# Altium schematic sheet 1_Triangle Wave Generator.SchDoc
size A4; SheetNumber: 2; SheetTotal: 6
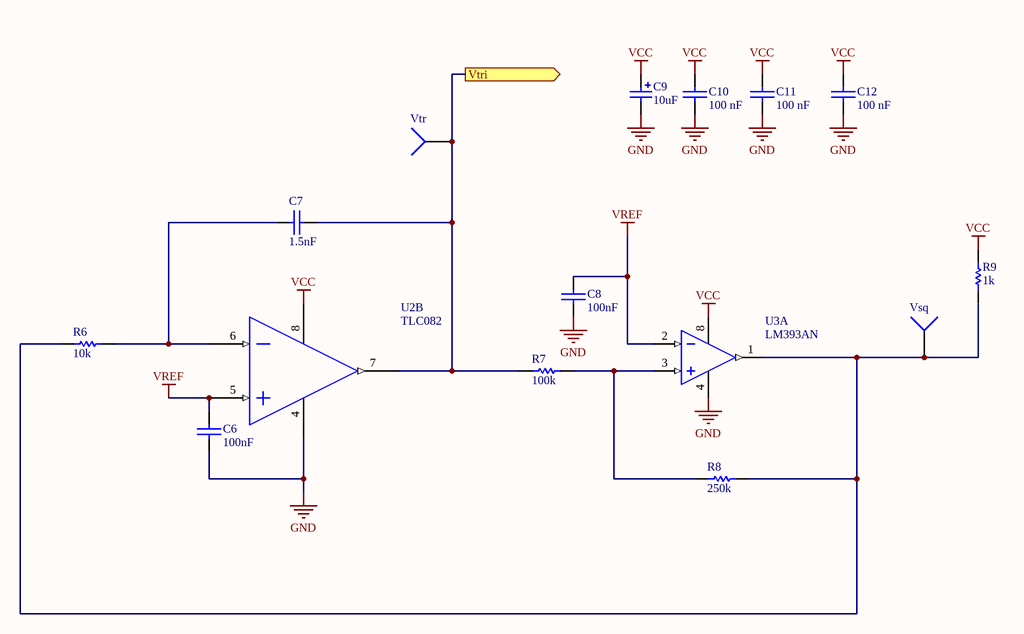
[diagram p0: 1_Triangle Wave Generator.SchDoc]

## Parts
C6  100nF  [ece-RAD0.2]
C7  1.5nF  [ece-RAD0.2]
C8  100nF  [ece-RAD0.2]
C9  10uF  [ece-CAPAD2TH0.3]
C10  100 nF  [ece-RAD0.2]
C11  100 nF  [ece-RAD0.2]
C12  100 nF  [ece-RAD0.2]
R6  10k  [ece-AXIAL0.4]
R7  100k  [ece-AXIAL0.4]
R8  250k  [ece-AXIAL0.4]
R9  1k  [ece-AXIAL0.4]
U2  TLC082  [ECE-DIP8]  (part B of 2)
U3  LM393AN  [ECE-DIP8]  (part A of 2)
Vsq  GND  [ece-HDR1]  (value not drawn)
Vtr  GND  [ece-HDR1]  (value not drawn)

## Ports
Vtri (out)

## Nets
GND: C6.1 C8.1 C9.2 C10.2 C11.2 C12.2 U2.4(GND) U3.4(GND)
VCC: C9.1 C10.1 C11.1 C12.1 R9.2 U2.8(V(+)) U3.8(V+)
VREF: C6.2 C8.2 U2.5(IN2(+)) U3.2(IN-)
Vtri: C7.2 R7.1 U2.7(OUT2) Vtr.1 ; port Vtri
NetC7_1: C7.1 R6.2 U2.6(IN2(-))
NetR6_1: R6.1 R8.2 R9.1 U3.1(OUT) Vsq.1
NetR7_2: R7.2 R8.1 U3.3(IN+)

## Library data of the parts
C6-C8 C10-C12 = CAP: Capacitor Non Polarised Through Hole
  C6 C8: Value: 100nF
  C7: Value: 1.5nF
  C10-C12: Value: 100 nF
C9 = CAP 22uF TH: Polarized Capacitor (Radial); Manufacturer: Generic Components; Class I: Passive; Published: 8-Jun-2000; Revision: July-2002: Re-released for DXP Platform.; Publisher: Altium Limited; Class II: Capacitor; Value: 10uF
R6-R9 = Res1: Resistor; Published: 8-Jun-2000; LatestRevisionDate: 17-Jul-2002; LatestRevisionNote: Re-released for DXP Platform.; PackageReference: AXIAL-0.3; Publisher: Altium Limited
  R6: Value: 10k
  R7: Value: 100k
  R8: Value: 250k
  R9: Value: 1k
U3 = LM393AN: Dual Comparator; Published: 17-Jul-2002; LatestRevisionDate: 06-Jun-2005; LatestRevisionNote: Stylized 3D Model Added.; DatasheetVersion: 1988; PackageReference: 626-05; Publisher: Altium Limited; PackageDescription: DIP; 8 Leads; Row Spacing 7.62 mm; Pitch 2.54 mm; ComponentLink1Description: Manufacturer Link; ComponentLink1URL: http://www.onsemi.com/site/products/taxonomy/0,4438,133,00.html
Vsq Vtr = Test pin: Socket; LatestRevisionDate: 17-Jul-2002; LatestRevisionNote: Re-released for DXP Platform.; Publisher: Altium Limited
U2 = TLC082: Value: TLC082